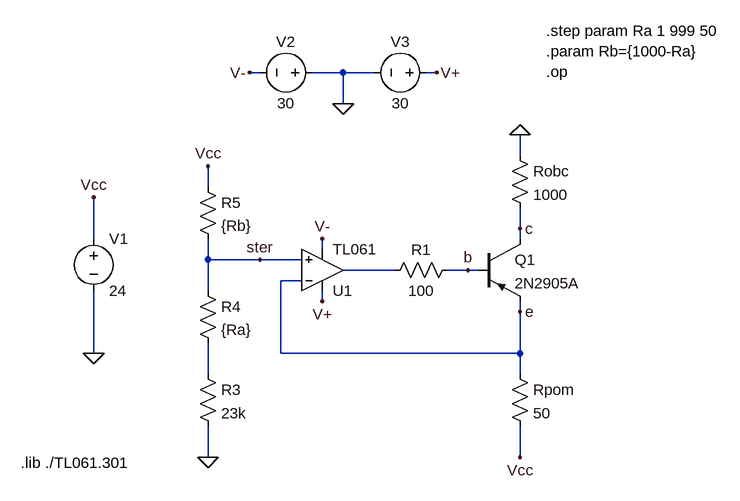
[diagram p0: schematic PNP.asc]
PNP.asc, the LTspice schematic file:
Version 4
SHEET 1 1128 680
WIRE 384 -272 368 -272
WIRE 512 -272 464 -272
WIRE 560 -272 512 -272
WIRE 656 -272 640 -272
WIRE 512 -224 512 -272
WIRE 784 -144 784 -176
WIRE 304 -96 304 -128
WIRE 784 -32 784 -64
WIRE 128 -16 128 -80
WIRE 784 -16 784 -32
WIRE 480 0 480 -16
WIRE 304 16 304 -16
WIRE 384 16 304 16
WIRE 448 16 384 16
WIRE 592 32 512 32
WIRE 704 32 672 32
WIRE 720 32 704 32
WIRE 448 48 416 48
WIRE 304 64 304 16
WIRE 480 80 480 64
WIRE 784 96 784 80
WIRE 128 160 128 64
WIRE 416 160 416 48
WIRE 784 160 784 96
WIRE 784 160 416 160
WIRE 304 192 304 144
WIRE 784 192 784 160
WIRE 304 320 304 272
WIRE 784 320 784 272
FLAG 128 -80 Vcc
FLAG 128 160 0
FLAG 512 -224 0
FLAG 656 -272 V+
FLAG 368 -272 V-
FLAG 480 -16 V-
FLAG 480 80 V+
FLAG 784 96 e
FLAG 784 -32 c
FLAG 704 32 b
FLAG 784 -176 0
FLAG 784 320 Vcc
FLAG 384 16 ster
FLAG 304 320 0
FLAG 304 -128 Vcc
SYMBOL voltage 128 -32 R0
WINDOW 123 0 0 Left 0
WINDOW 39 0 0 Left 0
SYMATTR InstName V1
SYMATTR Value 24
SYMBOL voltage 480 -272 R90
WINDOW 0 -32 56 VBottom 2
WINDOW 3 32 56 VTop 2
WINDOW 123 0 0 Left 0
WINDOW 39 0 0 Left 0
SYMATTR InstName V2
SYMATTR Value 30
SYMBOL voltage 656 -272 R90
WINDOW 0 -32 56 VBottom 2
WINDOW 3 32 56 VTop 2
WINDOW 123 0 0 Left 0
WINDOW 39 0 0 Left 0
SYMATTR InstName V3
SYMATTR Value 30
SYMBOL res 768 -160 R0
SYMATTR InstName Robc
SYMATTR Value 1000
SYMBOL res 768 176 R0
SYMATTR InstName Rpom
SYMATTR Value 50
SYMBOL res 688 16 R90
WINDOW 0 0 56 VBottom 2
WINDOW 3 32 56 VTop 2
SYMATTR InstName R1
SYMATTR Value 100
SYMBOL res 288 176 R0
SYMATTR InstName R3
SYMATTR Value 23k
SYMBOL res 288 48 R0
SYMATTR InstName R4
SYMATTR Value {Ra}
SYMBOL res 288 -112 R0
SYMATTR InstName R5
SYMATTR Value {Rb}
SYMBOL pnp 720 -16 R0
SYMATTR InstName Q1
SYMATTR Value 2N2905A
SYMBOL OpAmps\\opamp2 480 96 M180
SYMATTR InstName U1
SYMATTR Value TL061
TEXT 16 328 Left 2 !.lib ./TL061.301
TEXT 824 -336 Left 2 !.step param Ra 1 999 50\n.param Rb={1000-Ra}\n.op

The netlist it stands for:
* PNP.asc
V1 Vcc 0 24
V2 0 V- 30
V3 V+ 0 30
Robc 0 c 1000
Rpom e Vcc 50
R1 b N001 100
R3 N002 0 23k
R4 ster N002 {Ra}
R5 Vcc ster {Rb}
Q1 c b e 0 2N2905A
XU1 ster e V+ V- N001 TL061  ; pins In+ In- V+ V- OUT
.model NPN NPN
.model PNP PNP
.lib standard.bjt
.lib ./TL061.301
.step param Ra 1 999 50
.param Rb={1000-Ra}
.op
.backanno
.end

* Results of the author's LTspice run, read from the files saved beside the schematic
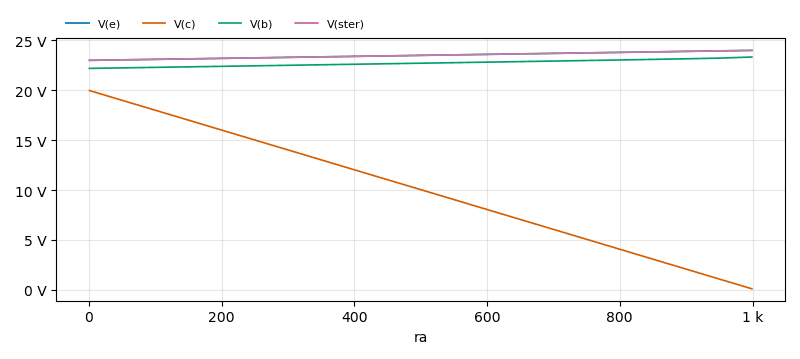
[diagram p1: Operating Point of PNP.asc, plotted from the saved traces]
* Operating Point, 1 run:
*   V(e): 23 V at ra=1 , 23.99 V at ra=999 , min 23 V, max 23.99 V
*   V(c): 19.97 V at ra=1 , 103.3 mV at ra=999 , min 103.3 mV, max 19.97 V
*   V(b): 22.19 V at ra=1 , 23.33 V at ra=999 , min 22.19 V, max 23.33 V
*   V(ster): 23 V at ra=1 , 24 V at ra=999 , min 23 V, max 24 V
* From the log:
*   Semiconductor Device Operating Points:
*                           --- Diodes ---
*   Name:    d:u1:p      d:u1:ln     d:u1:lp     d:u1:e      d:u1:c
*   Model:    u1:dx       u1:dx       u1:dx       u1:dx       u1:dx
*   Id:     -6.00e-11   -1.49e-11   -1.51e-11   -5.00e-11   -5.62e-12
*   Vd:     -6.00e+01   -1.49e+01   -1.51e+01   -5.00e+01   -5.62e+00
*   Req:     1.00e+12    1.00e+12    1.00e+12    1.00e+12    1.00e+12
*   CAP:     0.00e+00    0.00e+00    0.00e+00    0.00e+00    0.00e+00
*                           --- Bipolar Transistors ---
*   Name:       q1
*   Model:    2n2905a
*   Ib:      -8.74e-05
*   Ic:      -2.00e-02
*   Vbe:     -8.04e-01
*   Vbc:      2.22e+00
*   Vce:     -3.03e+00
*   BetaDC:   2.28e+02
*   Gm:       7.58e-01
*   Rpi:      2.98e+02
*   Rx:       1.00e+01
*   Ro:       5.90e+03
*   Cbe:      4.94e-10
*   Cbc:      7.05e-12
*   Cjs:      0.00e+00
*   BetaAC:   2.26e+02
*   Cbx:      0.00e+00
*   Ft:       2.41e+08
*                           --- JFET Transistors ---
*   Name:    j:u1:2      j:u1:1
*   Model:    u1:jx       u1:jx
*   Id:     -2.31e-05   -2.35e-05
*   Vgs:     5.20e-01    5.17e-01
*   Vds:    -5.22e+01   -5.22e+01
*   Gm:      9.64e-05    9.72e-05
*   Gds:     0.00e+00    0.00e+00
*   Cgs:     0.00e+00    0.00e+00
*   Cgd:     0.00e+00    0.00e+00